# EAGLE design testCircuit (EAGLE 7.5.0)
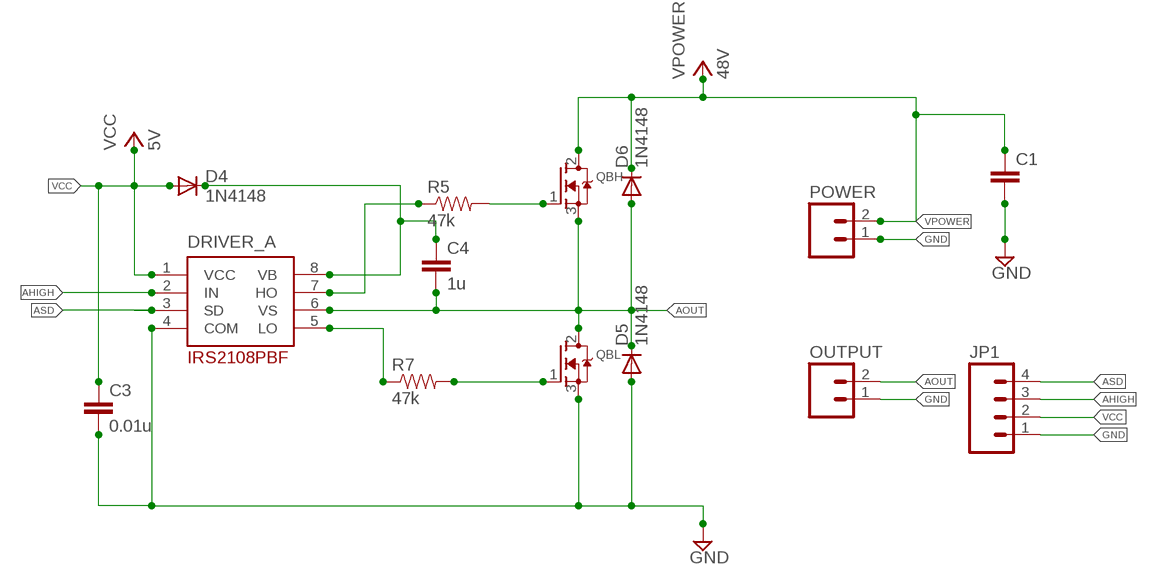
[diagram p0: schematic, sheet 1]

## Parts
C1  CAPPTH1  [CAP-PTH-5MM]
C3  0.01u  CAPPTH1  [CAP-PTH-5MM]
C4  1u  CAPPTH1  [CAP-PTH-5MM]
D4  1N4148  DIODEPTH  [DIODE-1N4001]
D5  1N4148  DIODEPTH  [DIODE-1N4001]
D6  1N4148  DIODEPTH  [DIODE-1N4001]
DRIVER_A  IRS2108PBF  [DIL08]
JP1  M04LONGPADS  [1X04_LONGPADS]
OUTPUT  TBLOCK-2  [TBLOCK-2]
POWER  TBLOCK-2  [TBLOCK-2]
QBH  MOSFET-NGDS_TO220V  [TO220V]
QBL  MOSFET-NGDS_TO220V  [TO220V]
R5  47k  RESISTORAXIAL-0.3  [AXIAL-0.3]
R7  47k  RESISTORAXIAL-0.3  [AXIAL-0.3]

## Nets
AHIGH: DRIVER_A.2(IN) JP1.3
AOUT: C4.2 D5.C D6.A DRIVER_A.6(VS) OUTPUT.2 QBH.3(S) QBL.2(D)
ASD: DRIVER_A.3(SD) JP1.4
GND: C1.2 C3.2 D5.A DRIVER_A.4(COM) JP1.1 OUTPUT.1 POWER.1 QBL.3(S)
N$2: C4.1 D4.C DRIVER_A.8(VB)
N$7: DRIVER_A.7(HO) R5.P$1
N$8: QBH.1(G) R5.P$2
N$9: DRIVER_A.5(LO) R7.P$1
N$10: QBL.1(G) R7.P$2
VCC: C3.1 D4.A DRIVER_A.1(VCC) JP1.2 ; supply symbol labelled 5V
VPOWER: C1.1 D6.C POWER.2 QBH.2(D) ; supply symbol labelled 48V

## Library data of the parts
C1 C3 C4 = SparkFun:CAP: Capacitor Standard 0603 ceramic capacitor, and 0.1" leaded capacitor.
D4-D6 = SparkFun:DIODE: Diode These are standard reverse protection diodes and small signal diodes. SMA package can handle up to about 1A. SOD-323 can handle about 200mA. What the SOD-323 package when ordering, there are some mfgs out there that are 5-pin packages.
DRIVER_A = ir:IRS2108PBF: Half bridge driver IRS2108PBF
JP1 = SparkFun:M04: Header 4 Standard 4-pin 0.1" header. Use with straight break away headers (SKU : PRT-00116), right angle break away headers (PRT-00553), swiss pins (PRT-00743), machine pins (PRT-00117), and female headers (PRT-00115). Molex polarized connector foot print use with SKU : PRT-08231 with associated crimp pins and housings.
OUTPUT POWER = akizuki_MOSFET:TBLOCK-2: terminal block 2pin
QBH QBL = adafruit:MOSFET-N: N-Channel Mosfet 2N7002E - 60V 260mA SOT23 [Digikey: 2N7002ET1GOSTR-ND] - REEL BSH103 - 30V 850mA SOT23 [Digikey: 568-5013-1-ND]
R5 R7 = SparkFun:RESISTOR: Resistor Basic schematic elements and footprints for 0603, 1206, and PTH resistors.

## Board
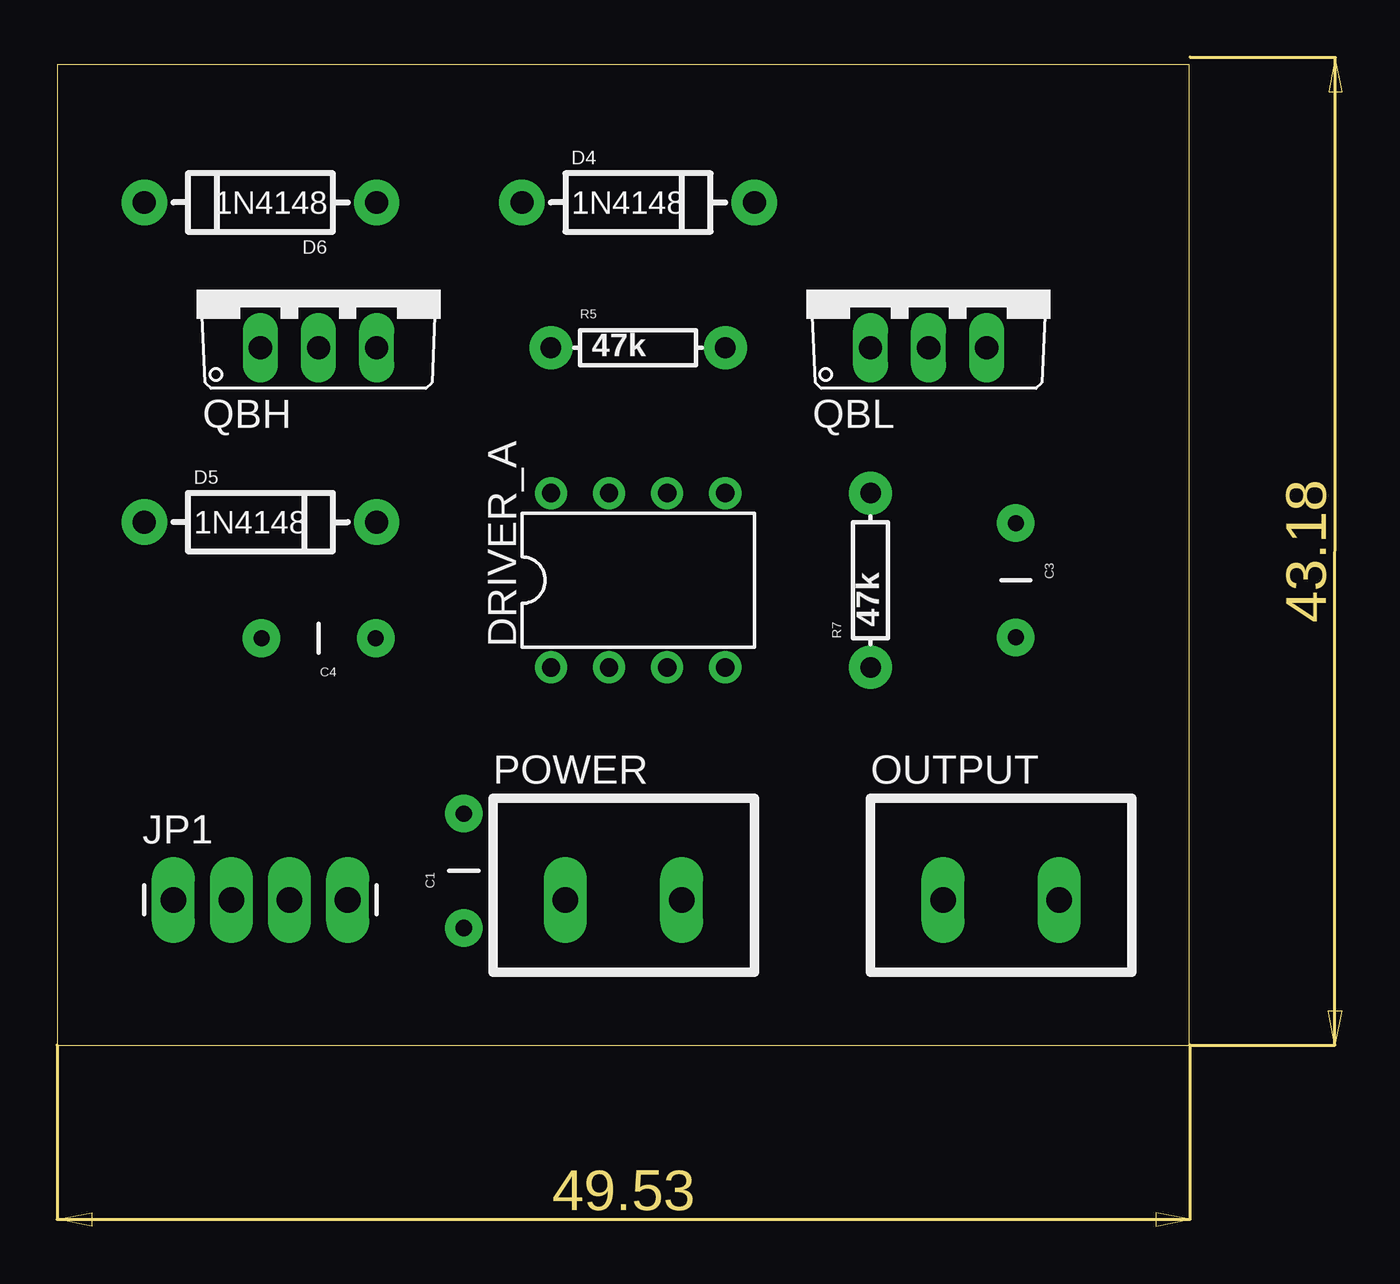
[diagram p1: board, top side]
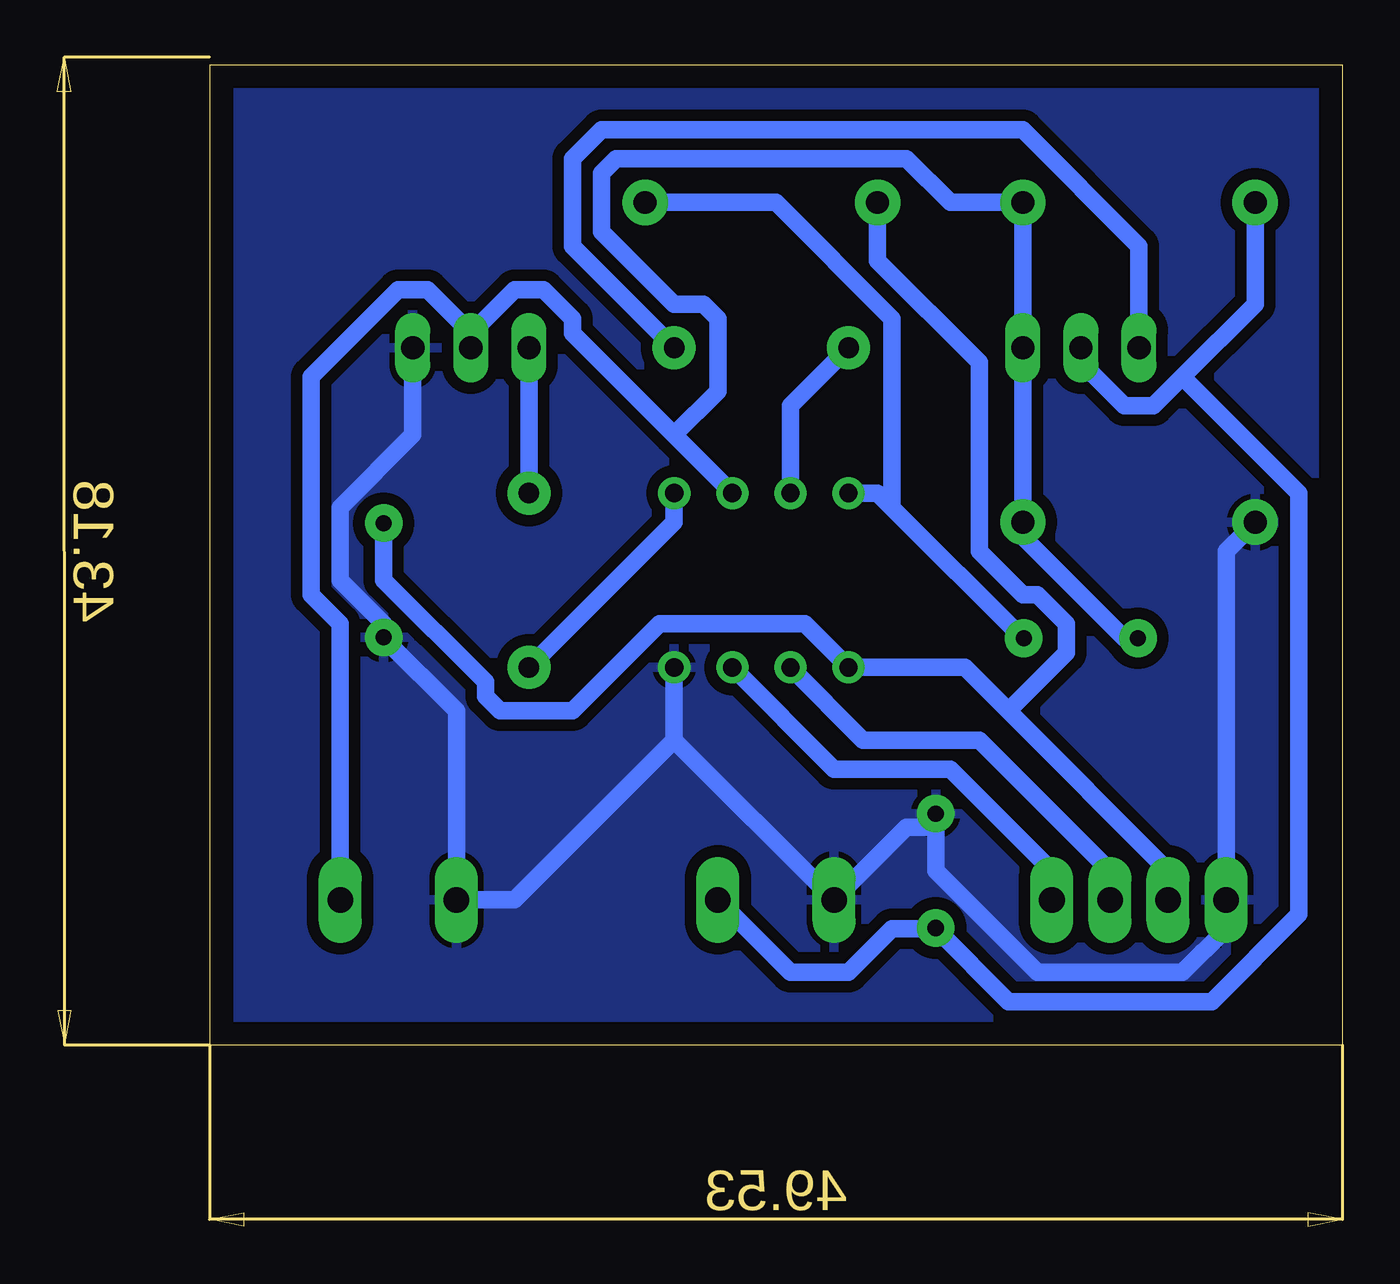
[diagram p2: board, bottom side, seen from below]

Size 49.51 x 42.85 mm. Coordinates in mm from the lower left corner, seen from the top.
Outline: 0,0 49.51,0 49.51,42.85 0,42.85 0,0
Copper layers (1*16): Top 0.035mm / dielectric 1.5mm / Bottom 0.035mm
Design rules "default *": minimum track width 30mil, minimum drill 24mil, track to track 20mil, track to pad 20mil, pad to pad 20mil, via to via 20mil, smd to smd 20mil, copper to edge 40mil, drill to drill 8mil, minimum pad ring 10mil, minimum via ring 8mil, stop-mask expansion 4mil, vias tented up to drill 0mil, thermal gap 10mil

### Footprints (pad centres in the part's own frame; a part is rotated, then mirrored left to right if it is on the bottom)
CAP-PTH-5MM = drill 0.7 pad 1.651: 1 -2.5,0; 2 2.5,0
DIODE-1N4001 = drill 1 pad 1.981: A -5.08,0; C 5.08,0
DIL08 = drill 0.8 pad 1.4: 1 -3.81,-3.81; 2 -1.27,-3.81; 3 1.27,-3.81; 4 3.81,-3.81; 5 3.81,3.81; 6 1.27,3.81; 7 -1.27,3.81; 8 -3.81,3.81
1X04_LONGPADS = drill 1.118 pad 1.88 long: 1 0,0; 2 2.54,0; 3 5.08,0; 4 7.62,0
TBLOCK-2 = drill 1.118 pad 1.88 long: 1 -3.175,0; 2 1.905,0
TO220V = drill 1.016 long: 1 -2.54,-2.54; 2 0,-2.54; 3 2.54,-2.54
AXIAL-0.3 = drill 0.9 pad 1.88: P$1 -3.81,0; P$2 3.81,0

### Placement (x,y rotation side)
C1  17.78,7.62 90 top
C3  41.91,20.32 270 top
C4  11.43,17.78 180 top
D4  25.4,36.83 0 top
D5  8.89,22.86 0 top
D6  8.89,36.83 180 top
DRIVER_A  25.4,20.32 0 top
JP1  5.08,6.35 0 top
OUTPUT  41.91,6.35 0 top
POWER  25.4,6.35 0 top
QBH  11.43,33.02 0 top
QBL  38.1,33.02 0 top
R5  25.4,30.48 0 top
R7  35.56,20.32 90 top

### Tracks (layer width: path | path; a pad name or v marks a point on that pad's centre or on a via)
AHIGH
  Bottom 0.762: DRIVER_A.2 20.95,13.34 15.88,13.34 10.16,7.62 JP1.3
AOUT
  Bottom 0.762: C4.2 9.53,17.78 13.97,22.23 D5.C QBH.3 D6.A 17.14,36.83 19.05,38.73 31.75,38.73 32.38,38.1 32.38,35.56 29.21,32.38 27.94,32.38 27.3,31.75 27.3,28.57 29.21,26.67 | 29.21,26.67 33.66,31.11 33.66,31.75 34.92,33.02 36.2,33.02 38.1,31.11 | 29.21,26.67 DRIVER_A.6 | OUTPUT.2 43.81,18.41 45.09,19.68 45.09,29.21 41.27,33.02 40.01,33.02 38.1,31.11 | 38.1,31.11 QBL.2
ASD
  Bottom 0.762: DRIVER_A.3 22.23,12.06 17.14,12.06 12.7,7.62 JP1.4
GND
  Bottom 0.762: QBL.3 40.64,26.67 43.81,23.5 43.81,20.32 41.91,18.41 C3.2 41.91,17.78 38.73,14.61 OUTPUT.1 36.2,6.35 29.21,13.34 | D5.A 5.08,21.59 JP1.1 5.08,5.08 6.99,3.17 13.34,3.17 17.78,7.62 17.78,9.53 | 29.21,13.34 DRIVER_A.4 | 29.21,13.34 POWER.1 19.05,9.53 17.78,9.53 | 17.78,9.53 C1.2
  pour Bottom: 0,0 49.53,0 49.53,43.18 0,43.18
N$2
  Bottom 0.762: DRIVER_A.8 20.32,24.13 19.68,23.5 | 19.68,23.5 13.97,17.78 C4.1 | D4.C 24.77,36.83 19.68,31.75 19.68,23.5
N$7
  Bottom 0.762: DRIVER_A.7 24.13,27.94 R5.P$1
N$8
  Bottom 0.762: QBH.1 8.89,34.92 13.97,40.01 32.38,40.01 33.66,38.73 33.66,34.92 R5.P$2
N$9
  Bottom 0.762: DRIVER_A.5 29.21,22.86 R7.P$1
N$10
  Bottom 0.762: R7.P$2 QBL.1
VCC
  Bottom 0.762: 14.61,14.61 7.62,7.62 JP1.2 | 14.61,14.61 16.51,16.51 DRIVER_A.1 23.5,18.41 29.84,18.41 33.66,14.61 36.83,14.61 37.47,15.24 37.47,15.88 41.91,20.32 C3.1 | D4.A 20.32,34.29 15.88,29.84 15.88,21.59 13.97,19.68 13.34,19.68 12.06,18.41 12.06,17.14 14.61,14.61
VPOWER
  Bottom 0.762: 17.78,5.08 19.68,5.08 21.59,3.17 24.13,3.17 POWER.2 | QBH.2 11.43,29.84 9.53,27.94 8.26,27.94 6.99,29.21 | 6.99,29.21 3.81,32.38 D6.C | 17.78,5.08 14.61,1.91 5.71,1.91 1.91,5.71 1.91,24.13 6.99,29.21 | 17.78,5.08 C1.1